# EAGLE schematic ll_target (EAGLE 8.1.0)
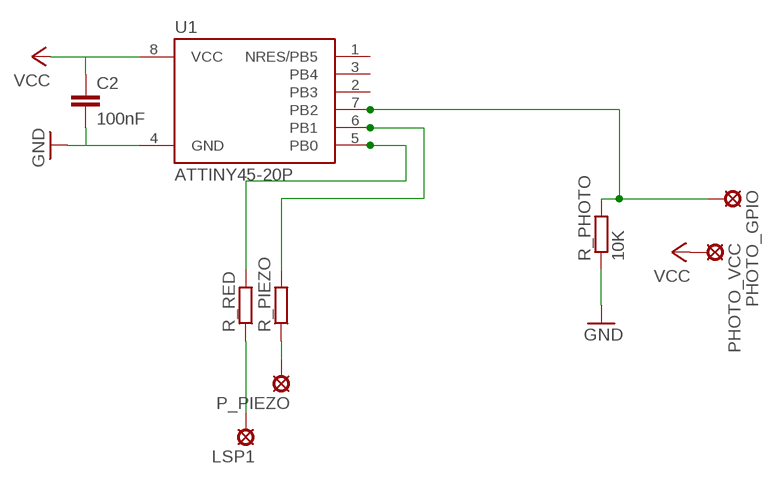
[diagram p0: schematic, sheet 1]

## Parts
C2  100nF  C-EU025-025X050  [C025-025X050]
LSP1  LSP10  [LSP10]
P_PIEZO  LSP10  [LSP10]
PHOTO_GPIO  LSP10  [LSP10]
PHOTO_VCC  LSP10  [LSP10]
R_PHOTO  10K  R-EU_0204/7  [0204/7]
R_PIEZO  R-EU_0204/7  [0204/7]
R_RED  R-EU_0204/7  [0204/7]
U1  ATTINY45-20P  [PDIP08_300MIL]

## Nets
GND: C2.2 R_PHOTO.1 U1.4(GND)
MISO: R_PIEZO.2 U1.6(PB1)
MOSI: R_RED.2 U1.5(PB0)
N$2: P_PIEZO.MP R_PIEZO.1
N$4: LSP1.MP R_RED.1
SCK: PHOTO_GPIO.MP R_PHOTO.2 U1.7(PB2)
VCC: C2.1 PHOTO_VCC.MP U1.8(VCC)
Unconnected: U1.1(NRES/PB5) U1.2(PB3) U1.3(PB4)

## Library data of the parts
C2 = rcl:C-EU: CAPACITOR, European symbol
LSP1 P_PIEZO PHOTO_GPIO PHOTO_VCC = solpad:LSP10: SOLDER PAD drill 1.0 mm, distributor Buerklin, 12H555
R_PHOTO R_PIEZO R_RED = rcl:R-EU_: RESISTOR, European symbol
U1 = attiny25_45_85:ATTINY45*: ATMEL ATtiny 45 Packages: P = PDIP 08 30mil S = SOIC 08 EIAJ 208mil X = TSSOP 08 4.4mm Technologies Note: for complete ordering code (temp. range, finish, tape&reel etc.) see www.atmel.com • Supply Voltage: V = (1.8…5.5)V | [blank] = (2.7…5.5)V • Speed: 10 = 10 MHz | 20 = 20 MHz Author: Dipl.-Ing. FH Rainer Bayer HHN Hochschule Heilbronn (Heilbronn University), rainer.bayer@hs-heilbronn.de Ingenieurbüro ing-rb, mail@ing-rb.de